# EAGLE schematic ArduinoLogger (EAGLE 9.3.1)
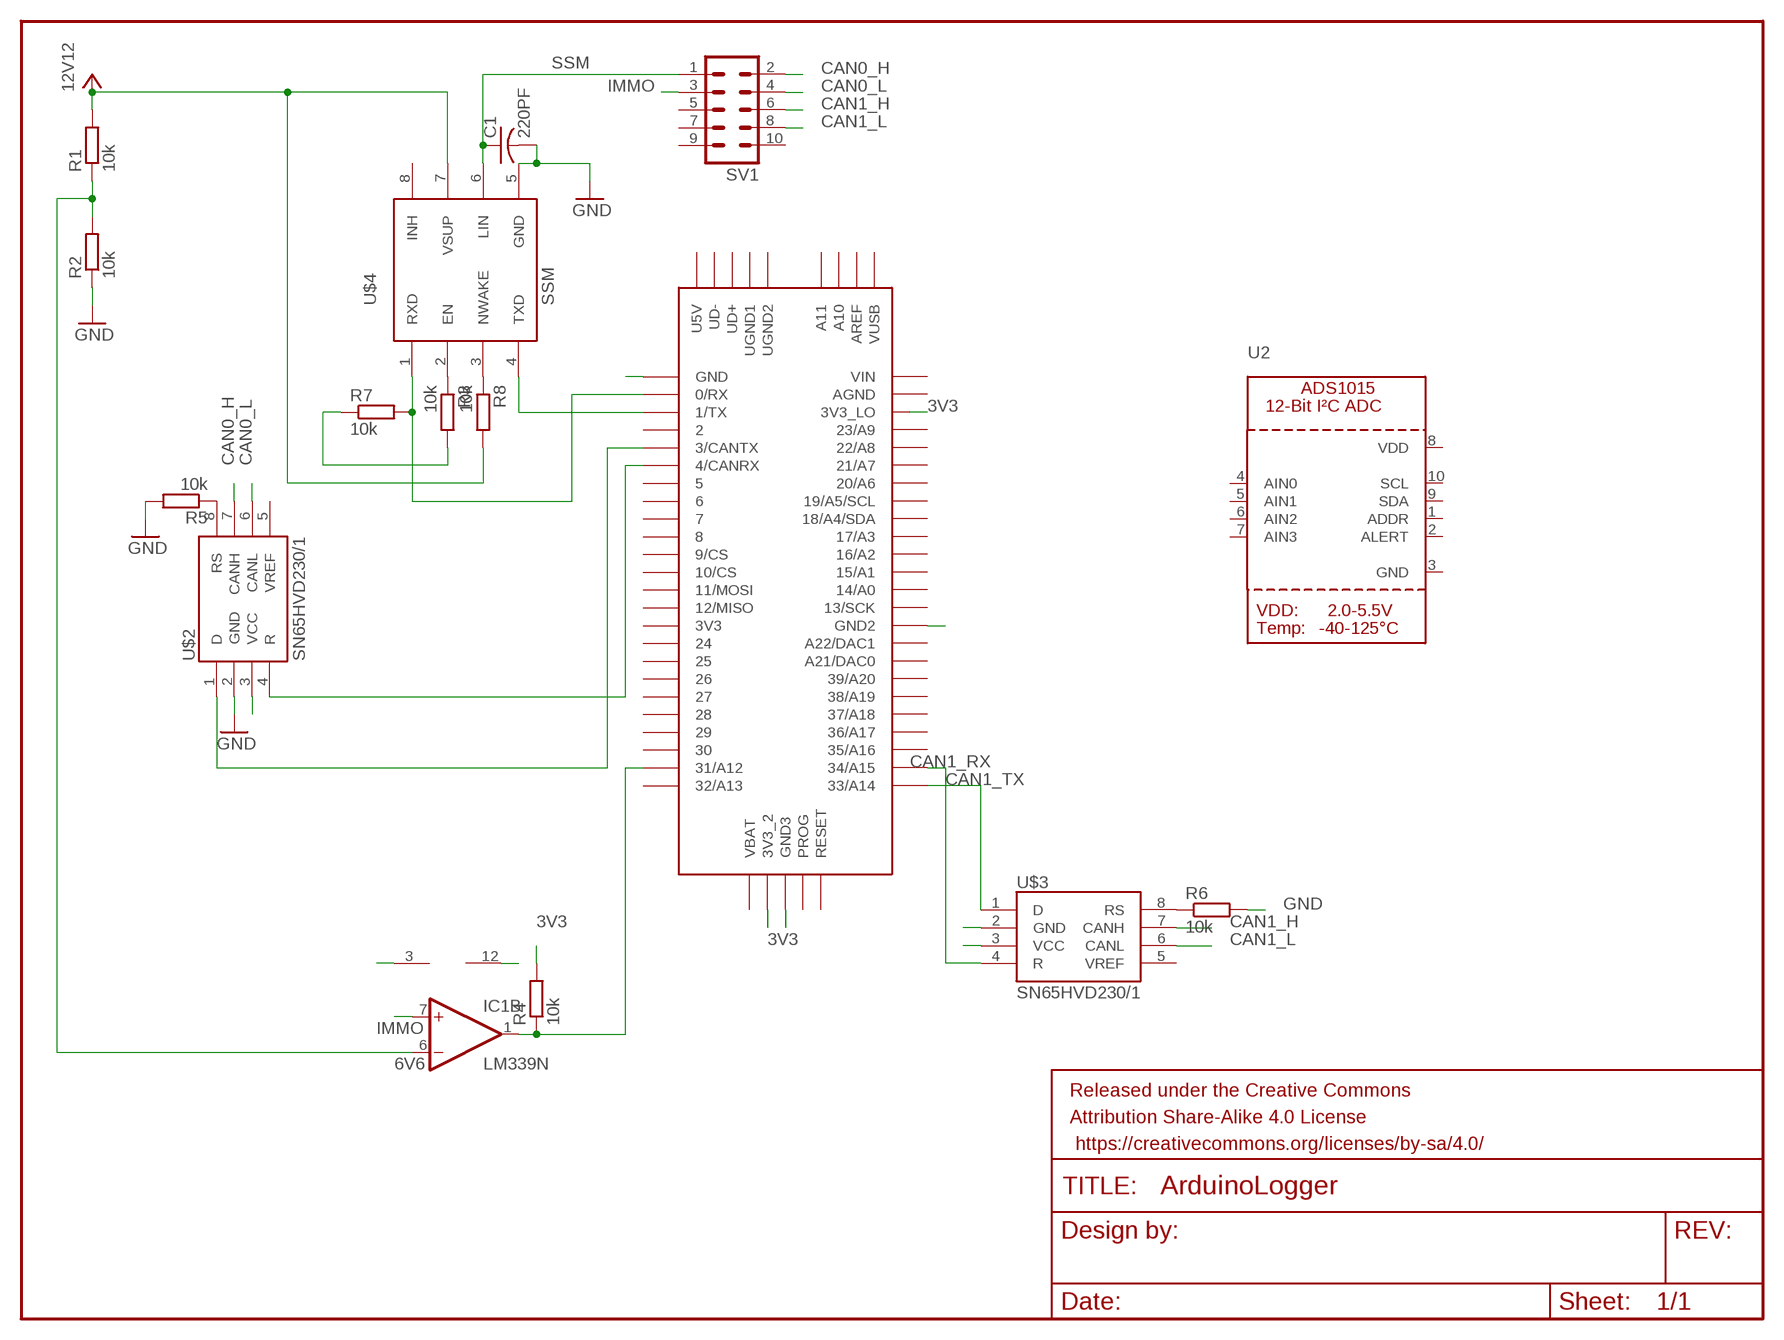
[diagram p0: schematic, sheet 1]

## Parts
C1  220PF  C-US050-024X044  [C050-024X044]
FRAME1  FRAME-LETTER  [CREATIVE_COMMONS]
IC1  LM339N  [DIL14]
R1  10k  R0204/7  [0204/7]
R2  10k  R0204/7  [0204/7]
R3  10k  R0204/7  [0204/7]
R4  10k  R0204/7  [0204/7]
R5  10k  R0204/7  [0204/7]
R6  10k  R0204/7  [0204/7]
R7  10k  R0204/7  [0204/7]
R8  10k  R0204/7  [0204/7]
SV1  MA05-2  [MA05-2]
U2  ADC_ADS1015  [MSOP10]
U$1  TEENSY_3.5/3.6  [TEENSY_3.5/3.6]
U$2  SN65HVD230/1  [SO8]
U$3  SN65HVD230/1  [SO8]
U$4  SSM  SN65HDVA195-Q1SOIC8  [SOIC8]

## Nets
3V3: R3.2 R4.2 R7.1 U$1.3V3_2 U$1.3V3_LO U$2.3(VCC) U$3.3(VCC)
6V6: IC1.6(B:-IN) R1.1 R2.2
+12V: IC1.3(P:V+) R1.2 R8.2 U$4.7(VSUP) ; supply symbol labelled 12V12
CAN0_H: SV1.2 U$2.7(CANH)
CAN0_L: SV1.4 U$2.6(CANL)
CAN1_H: SV1.6 U$3.7(CANH)
CAN1_L: SV1.8 U$3.6(CANL)
CAN1_RX: U$1.34/A15 U$3.4(R)
CAN1_TX: U$1.33/A14 U$3.1(D)
GND: C1.2 IC1.12(P:GND) R2.1 R5.2 R6.2 U$1.GND U$1.GND2 U$1.GND3 U$2.2(GND) U$3.2(GND) U$4.5(GND)
IMMO: IC1.7(B:+IN) SV1.3
N$1: U$1.3/CANTX U$2.1(D)
N$2: IC1.1(B:OUT) R4.1 U$1.31/A12
N$3: R7.2 U$1.0/RX U$4.1(RXD)
N$4: R3.1 U$4.2(EN)
N$5: R8.1 U$4.3(NWAKE)
N$6: U$1.4/CANRX U$2.4(R)
N$7: R5.1 U$2.8(RS)
N$8: R6.1 U$3.8(RS)
N$11: U$1.1/TX U$4.4(TXD)
SSM: C1.1 SV1.1 U$4.6(LIN)
Unconnected: IC1.2(A:OUT) IC1.4(A:-IN) IC1.5(A:+IN) IC1.8(C:-IN) IC1.9(C:+IN) IC1.10(D:-IN) IC1.11(D:+IN) IC1.13(D:OUT) IC1.14(C:OUT) SV1.5 SV1.7 SV1.9 SV1.10 U2.1(ADDR) U2.2(ALERT) U2.3(GND) U2.4(AIN0) U2.5(AIN1) U2.6(AIN2) U2.7(AIN3) U2.8(VDD) U2.9(SDA) U2.10(SCL) U$1.2 U$1.3V3 U$1.5 U$1.6 U$1.7 U$1.8 U$1.9/CS U$1.10/CS U$1.11/MOSI U$1.12/MISO U$1.13/SCK U$1.14/A0 U$1.15/A1 U$1.16/A2 U$1.17/A3 U$1.18/A4/SDA U$1.19/A5/SCL U$1.20/A6 U$1.21/A7 U$1.21/DAC0(A21/DAC0) U$1.22/A8 U$1.23/A9 U$1.24 U$1.25 U$1.26 U$1.27 U$1.28 U$1.29 U$1.30 U$1.32/A13 U$1.35/A16 U$1.36/A17 U$1.37/A18 U$1.38/A19 U$1.39/A20 U$1.A10 U$1.A11 U$1.A22/DAC1 U$1.AGND U$1.AREF U$1.PROG U$1.RESET U$1.U5V U$1.UD+ U$1.UD- U$1.UGND1 U$1.UGND2 U$1.VBAT U$1.VIN U$1.VUSB U$2.5(VREF) U$3.5(VREF) U$4.8(INH)

## Library data of the parts
C1 = adafruit:C-US: CAPACITOR, American symbol
FRAME1 = SparkFun-Aesthetics:FRAME-LETTER: Schematic Frame - Letter Standard 8.5x11 US Letter frame
IC1 = linear3:LM339: Low Power Low Offset Voltage Quad Comparators with open collector; LM139/LM239/LM339/LM2901/LM3302; SPICEPREFIX: J
R1-R8 = eagle-ltspice:R: RESISTOR, European symbol; SPICEMODEL: NONE; SPICEPREFIX: R
SV1 = con-lstb:MA05-2: PIN HEADER; OC_FARNELL: unknown; OC_NEWARK: unknown
U2 = microbuilder:ADC_ADS1015: ADS1015 - 12-bit 4-Channel I2C ADC with Internal PGA VDD: 2.0-5.5V Sampling Rate: 3.3ksps Gain Settings: 2/3, 1, 2, 4, 8, 16 I2C Address: ADDR low = 1001000x, ADDR high = 1001001x Internal Comparator The ADS1015 includes an internal comparator that can be set to output a high-level on ALERT when the conversion results exceeeds a pre-defined upper level, and will deassert itself when the level falls below a pre-defined lower threshold level. It can also be set to windowed mode where the ALERT pin will be asserted if the data exceeds the upper threshold or falls below the lower threshold.
U$1 = Teensy356:TEENSY_3.5/3.6
U$2 U$3 = texas_instruments:SN65HVD230/1
U$4 = subieduino-lib:SN65HDVA195-Q1